# EAGLE design Verzerrer (EAGLE 7.2.0)
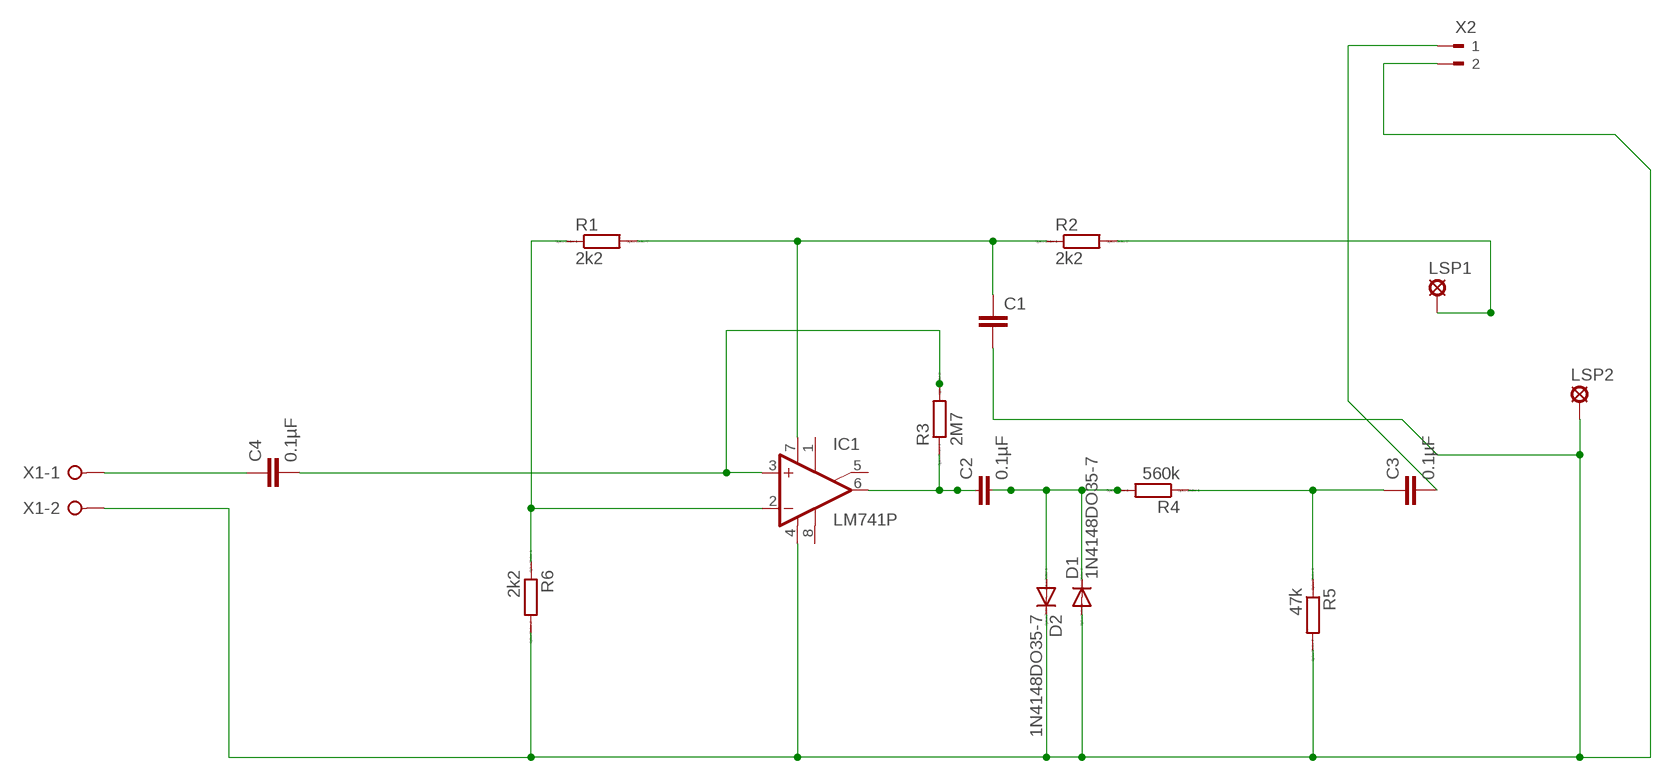
[diagram p0: schematic, sheet 1]

## Parts
C1  C5/2.5  [C5B2.5]
C2  0.1µF  C5/2.5  [C5B2.5]
C3  0.1µF  C5/2.5  [C5B2.5]
C4  0.1µF  C5/2.5  [C5B2.5]
D1  1N4148DO35-7  [DO35-7]
D2  1N4148DO35-7  [DO35-7]
IC1  LM741P  [DIL08]
LSP1  LSP11  [LSP11]
LSP2  LSP11  [LSP11]
R1  2k2  R0207/10  [0207/10]
R2  2k2  R0207/10  [0207/10]
R3  2M7  R0207/10  [0207/10]
R4  560k  R0207/10  [0207/10]
R5  47k  R0207/10  [0207/10]
R6  2k2  R0207/10  [0207/10]
X1  W237-2N  [W237-2N]
X2  180-2  [180-2]

## Nets
N$1: IC1.2(-IN) R1.1 R6.1
N$2: C2.1 IC1.6(OUT) R3.1
N$3: C2.2 D1.C D2.A R4.2
N$4: C4.2 IC1.3(+IN) R3.2
N$5: LSP1.MP R2.2
N$6: C1.1 IC1.7(V+) R1.2 R2.1
N$7: C1.2 D1.A D2.C IC1.4(V-) LSP2.MP R5.2 R6.2 X1.2 X2.2
N$8: C3.1 R4.1 R5.1
N$9: C3.2 X2.1
N$10: C4.1 X1.1
Unconnected: IC1.1(ON1) IC1.5(ON2) IC1.8(OPT)

## Library data of the parts
C1-C4 = capacitor-wima:C: CAPACITOR naming: grid - package width
D1 D2 = diode:1N4148: DIODE high speed (Philips)
IC1 = linear:*741: OP AMP
LSP1 LSP2 = solpad:LSP11: SOLDER PAD drill 1.1 mm
R1-R6 = eagle-ltspice:R: RESISTOR, European symbol; SPICEMODEL: NONE; SPICEPREFIX: R
X1 = con-wago-508:W237-2N: WAGO SREW CLAMP; OC_FARNELL: unknown; OC_NEWARK: unknown
X2 = con-weidmueller-sl35:180-2: WEIDMUELLER CLAMP CONNECTOR; OC_FARNELL: unknown; OC_NEWARK: unknown

## Board
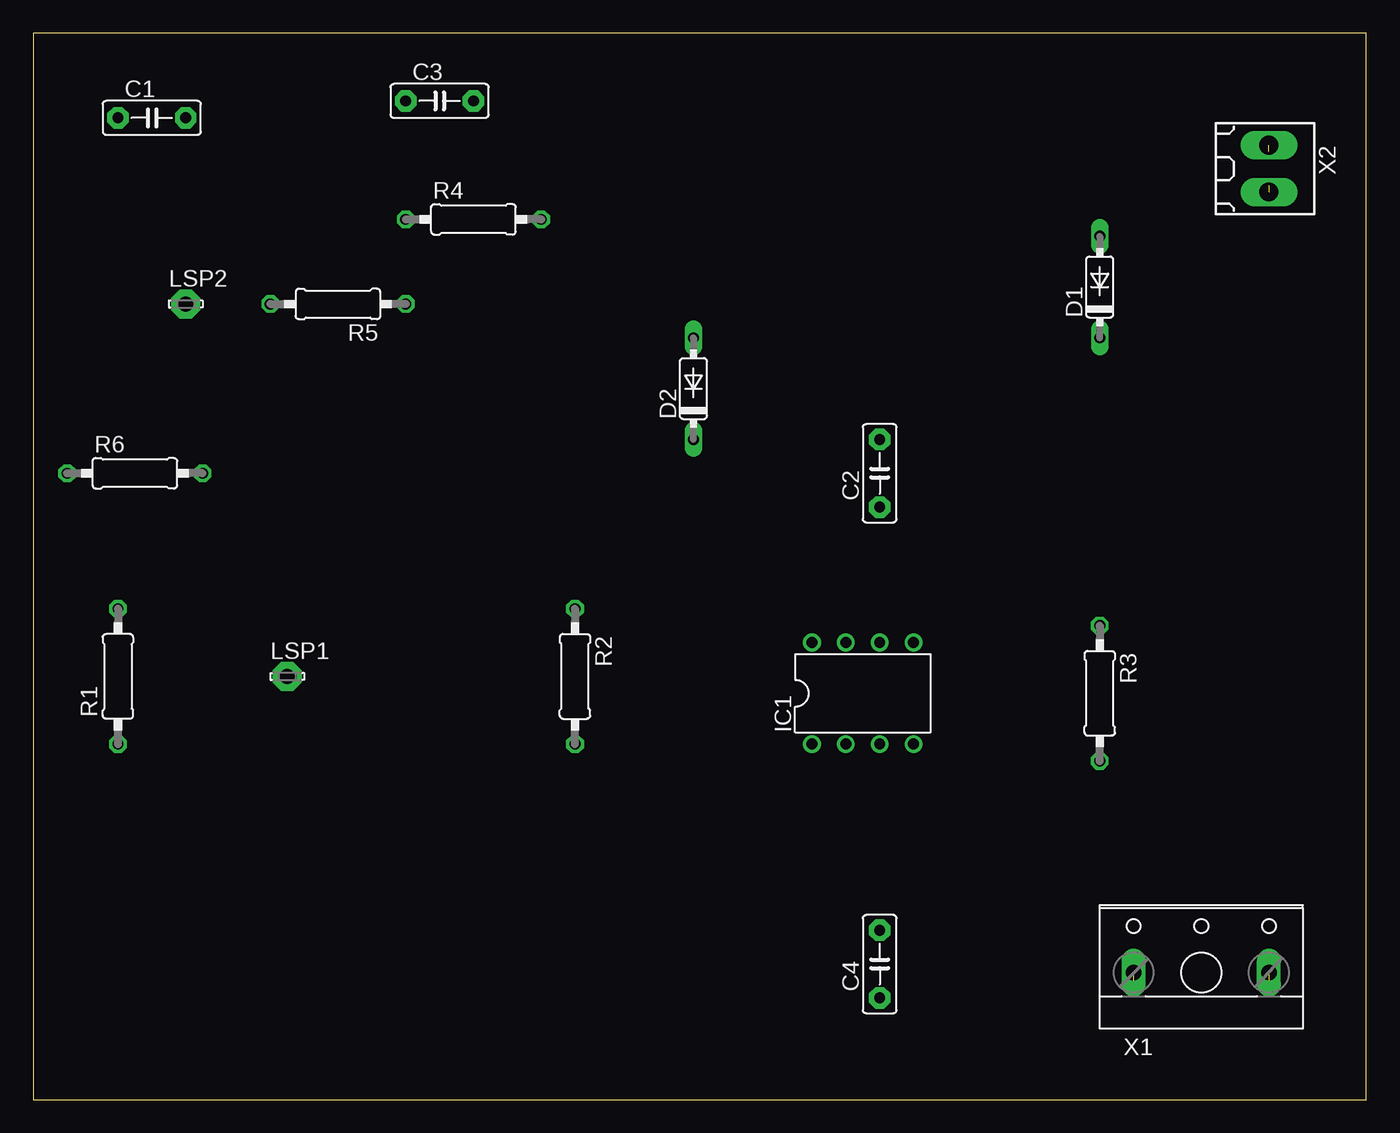
[diagram p1: board, top side]
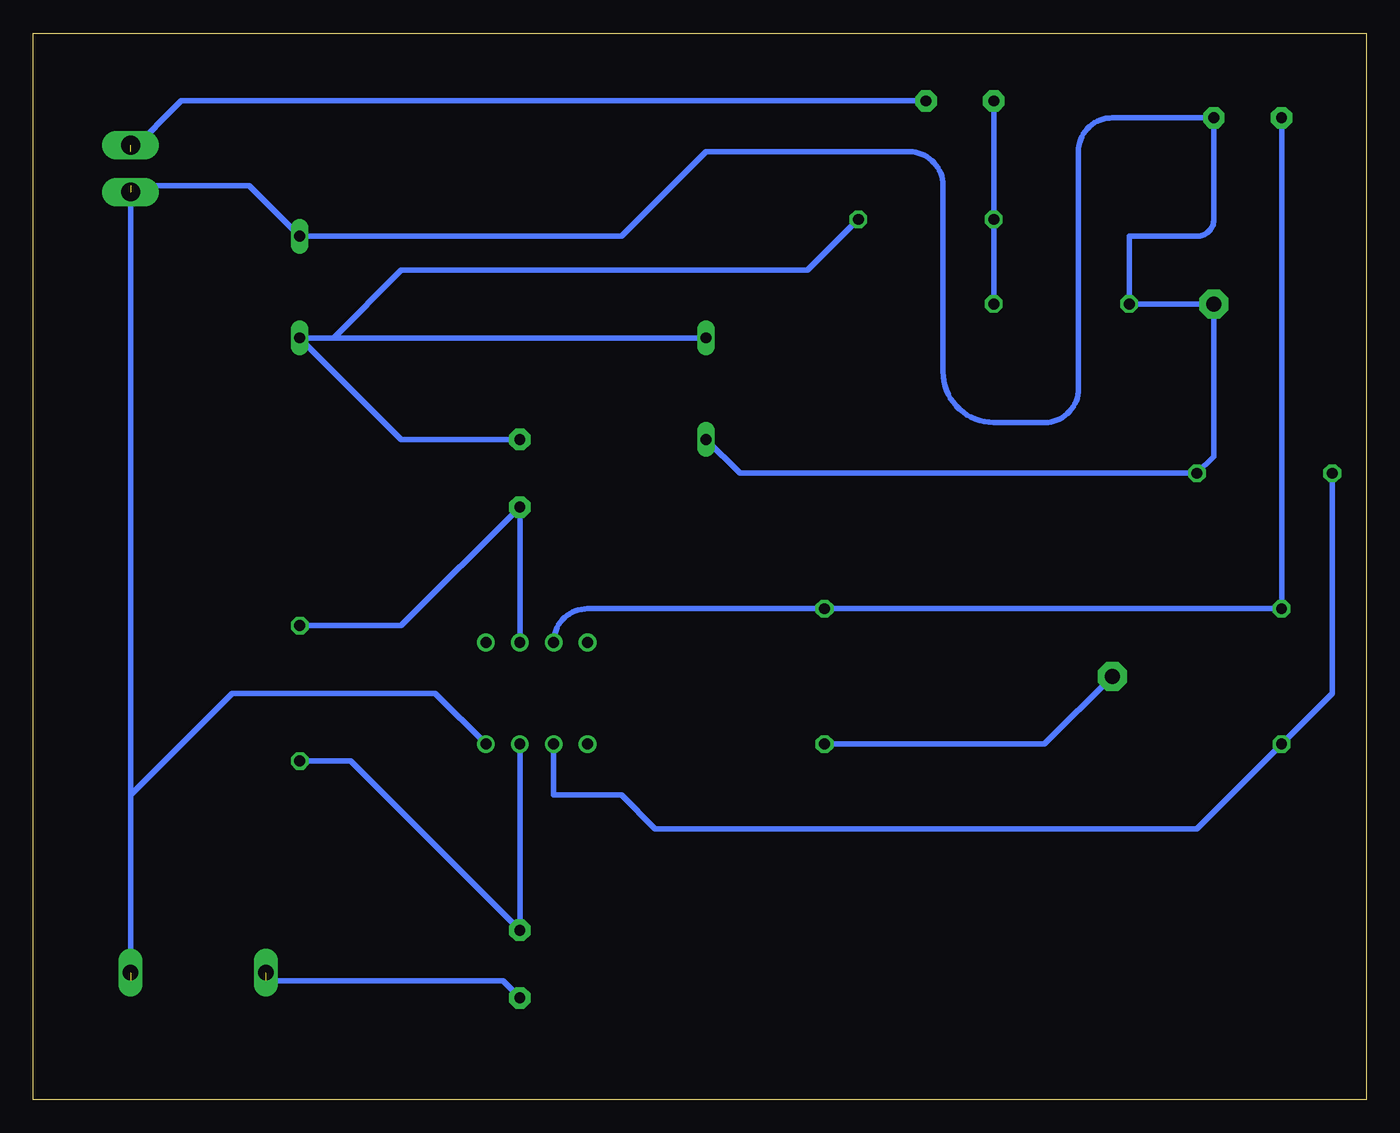
[diagram p2: board, bottom side, seen from below]

Size 100 x 80 mm. Coordinates in mm from the lower left corner, seen from the top.
Outline: 0,0 100,0 100,80 0,80 0,0
Copper layers (1*16): Top 0.035mm / dielectric 1.5mm / Bottom 0.035mm
Design rules "default": minimum track width 10mil, minimum drill 24mil, track to track 8mil, track to pad 8mil, pad to pad 8mil, via to via 8mil, smd to smd 8mil, copper to edge 40mil, drill to drill 8mil, minimum pad ring 10mil, minimum via ring 8mil, stop-mask expansion 4mil, vias tented up to drill 0mil, thermal gap 10mil

### Footprints (pad centres in the part's own frame; a part is rotated, then mirrored left to right if it is on the bottom)
C5B2.5 = drill 0.813 pad 1.6 octagon: 1 -2.54,0; 2 2.54,0
DO35-7 = drill 0.813 long: A 3.81,0; C -3.81,0
DIL08 = drill 0.813 pad 1.27: 1 -3.81,-3.81; 2 -1.27,-3.81; 3 1.27,-3.81; 4 3.81,-3.81; 5 3.81,3.81; 6 1.27,3.81; 7 -1.27,3.81; 8 -3.81,3.81
LSP11 = drill 1.118 pad 2.159 octagon: MP 0,0
0207/10 = drill 0.813 octagon: 1 -5.08,0; 2 5.08,0
W237-2N = drill 1.194 long: 1 -5.08,-0.635; 2 5.08,-0.635
180-2 = drill 1.422 long: 1 -1.75,0; 2 1.75,0

### Placement (x,y rotation side)
C1  8.89,73.66 0 top
C2  63.5,46.99 90 top
C3  30.48,74.93 0 top
C4  63.5,10.16 90 top
D1  80.01,60.96 90 top
D2  49.53,53.34 90 top
IC1  62.23,30.48 0 top
LSP1  19.05,31.75 0 top
LSP2  11.43,59.69 0 top
R1  6.35,31.75 90 top
R2  40.64,31.75 270 top
R3  80.01,30.48 270 top
R4  33.02,66.04 0 top
R5  22.86,59.69 180 top
R6  7.62,46.99 0 top
X1  87.63,10.16 0 top
X2  92.71,69.85 270 top

### Tracks (layer width: path | path; a pad name or v marks a point on that pad's centre or on a via)
N$1
  Bottom 0.406: R6.1 2.54,30.48 R1.1 12.7,20.32 53.34,20.32 55.88,22.86 60.96,22.86 IC1.2
N$2
  Bottom 0.406: R3.1 72.39,35.56 C2.1 IC1.6
N$3
  Bottom 0.406: D2.A D1.C | D1.C 77.47,57.15 72.39,62.23 41.91,62.23 R4.2 | D1.C 72.39,49.53 C2.2
N$4
  Bottom 0.406: IC1.3 C4.2 76.2,25.4 R3.2
N$5
  Bottom 0.406: LSP1.MP 24.13,26.67 R2.2
N$6
  Bottom 0.406: C1.1 R1.2 R2.1 58.42,36.83 arc-90 IC1.7
N$7  (2 unrouted)
  Bottom 0.406: D2.C 46.99,46.99 R6.2 11.43,48.26 LSP2.MP R5.2 17.78,64.77 12.7,64.77 arc-90 11.43,66.04 C1.2 19.05,73.66 arc-90 21.59,71.12 21.59,53.34 arc90 24.13,50.8 27.94,50.8 arc90 31.75,54.61 31.75,68.58 arc-90 34.29,71.12 49.53,71.12 55.88,64.77 D1.A 83.82,68.58 92.71,68.58 92.71,22.86 | IC1.4 69.85,30.48 85.09,30.48 92.71,22.86 | 92.71,22.86 92.71,8.89
N$8
  Bottom 0.406: C3.1 27.94,67.31 R4.1 R5.1
N$9  (1 unrouted)
  Bottom 0.406: 92.71,71.12 88.9,74.93 C3.2
N$10  (1 unrouted)
  Bottom 0.406: C4.1 64.77,8.89 82.55,8.89